# EAGLE design kinesis-advantage-v2.5 (EAGLE 7.2.0)
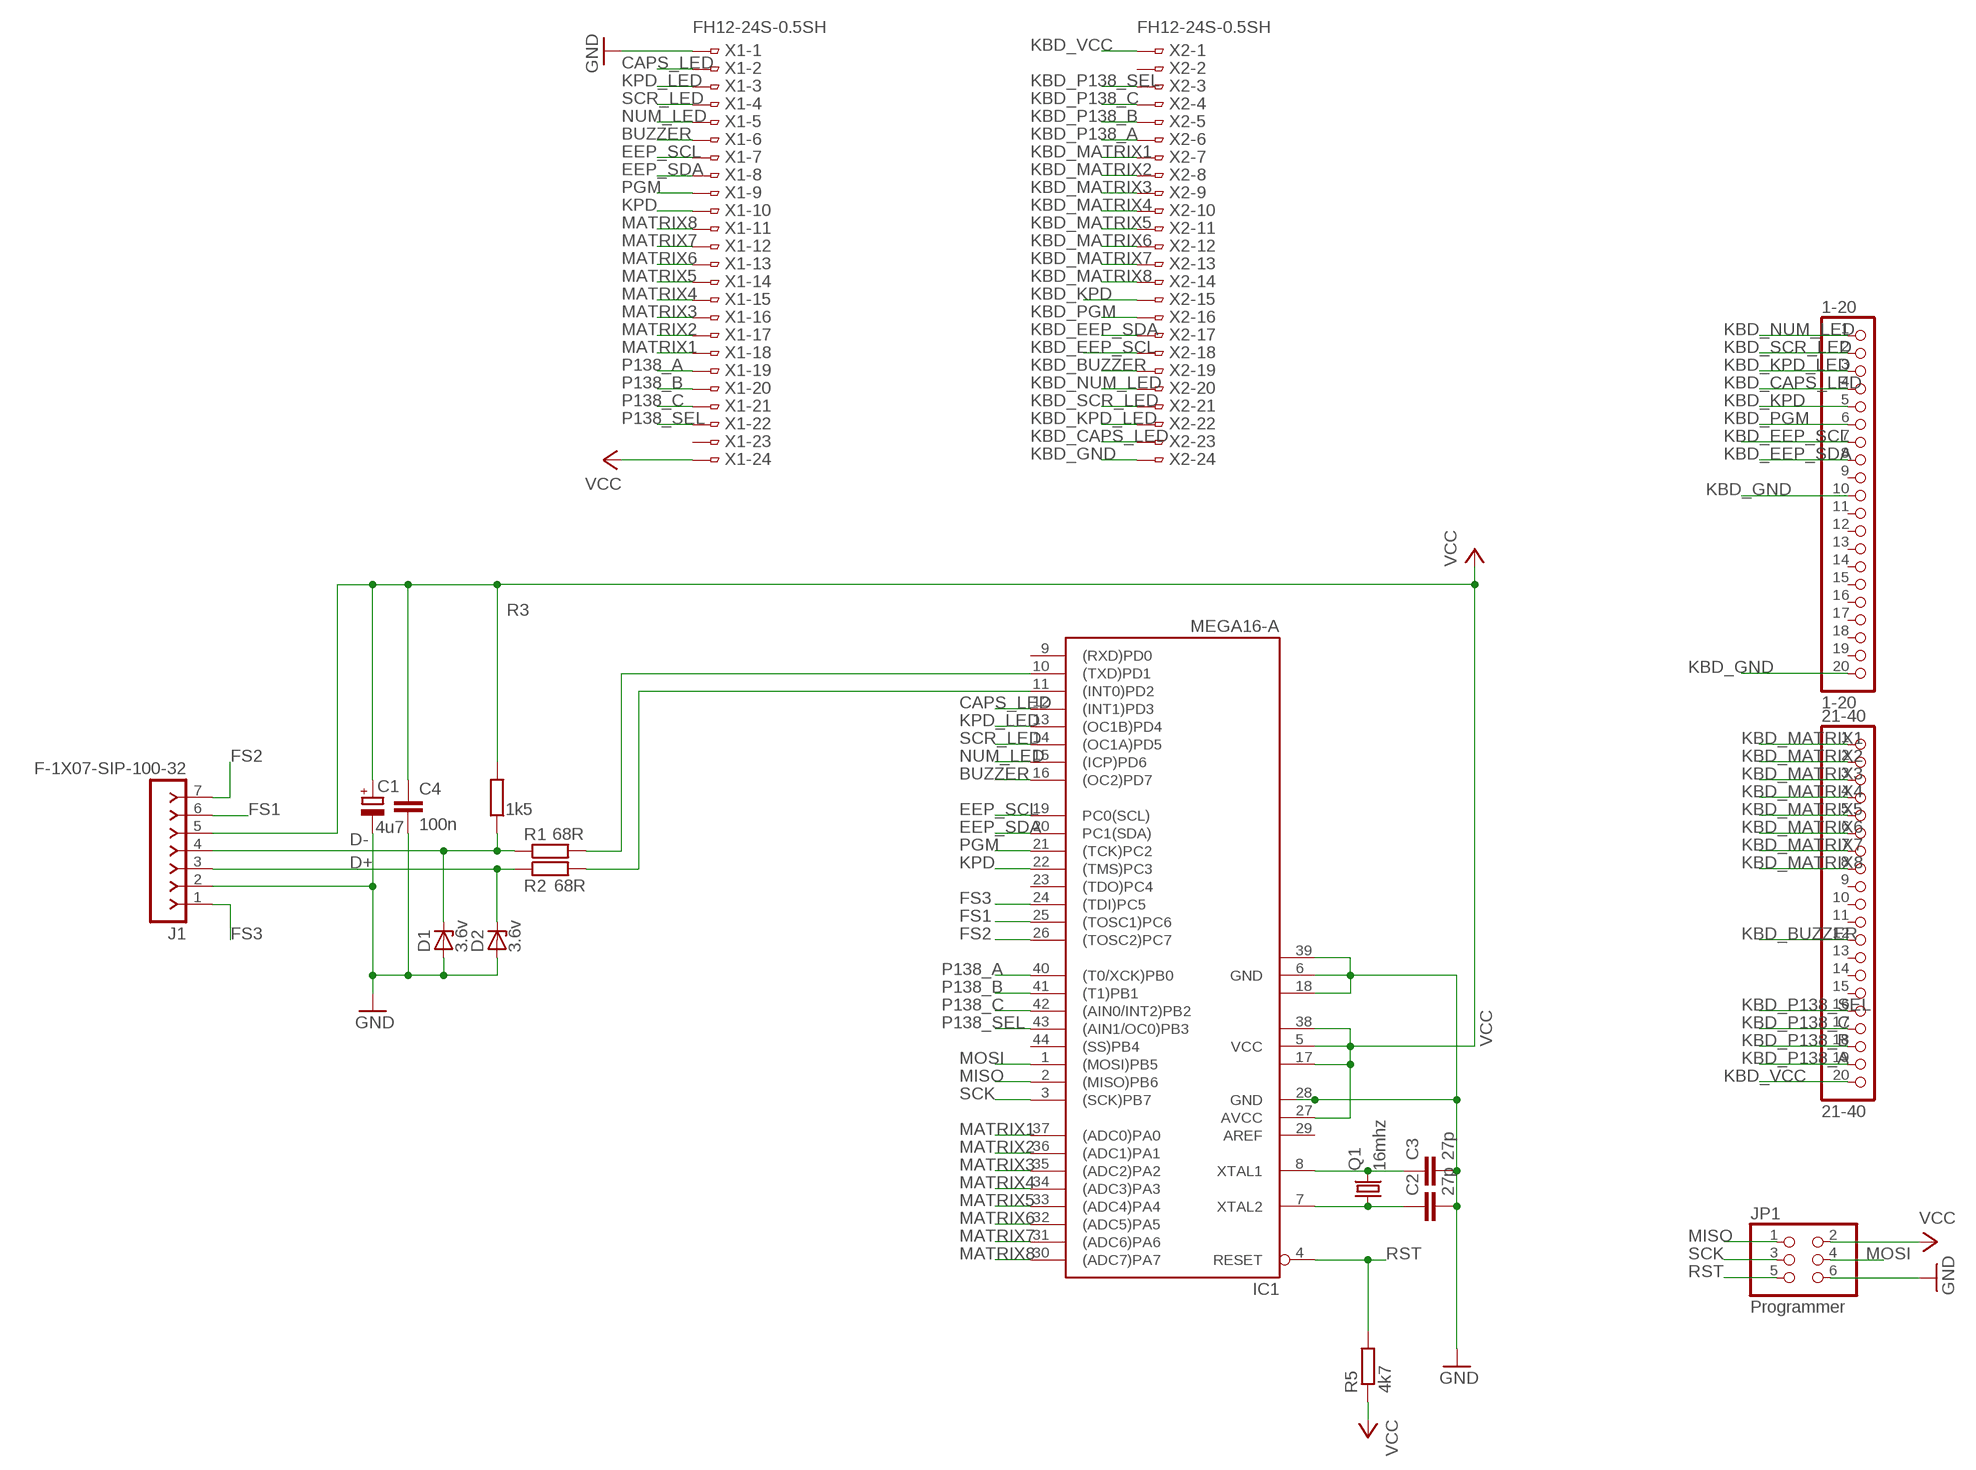
[diagram p0: schematic, sheet 1]

## Parts
1-20  1-20  PINHD-1X20-BIG  [1X20-BIG]
21-40  21-40  PINHD-1X20-BIG  [1X20-BIG]
C1  4u7  CPOL-EUE2-5  [E2-5]
C2  27p  C-EUC0603  [C0603]
C3  27p  C-EUC0603  [C0603]
C4  100n  C-EUC0603  [C0603]
D1  3.6v  ZENER-DIODESOD80C  [SOD80C]
D2  3.6v  ZENER-DIODESOD80C  [SOD80C]
IC1  MEGA16-A  [TQFP44]
J1  F-1X07-SIP-100-32  [SIP-100-07-32]
JP1  Programmer  PINHD-2X3  [2X03]
Q1  16mhz  CRYSTALHC49S  [HC49/S]
R1  68R  R-EU_R0603  [R0603]
R2  68R  R-EU_R0603  [R0603]
R3  1k5  R-EU_R0603  [R0603]
R5  4k7  R-EU_R0603  [R0603]
X1  FH12-24S-0.5SH  [FH12-24S-0.5SH]
X2  FH12-24S-0.5SH  [FH12-24S-0.5SH]

## Nets
BUZZER: IC1.16((OC2)PD7) X1.6
CAPS_LED: IC1.12((INT1)PD3) X1.2
CHIP-D+: IC1.11((INT0)PD2) R2.2
CHIP-D-: IC1.10((TXD)PD1) R1.2
D+: D2.C J1.3 R2.1
D-: D1.C J1.4 R1.1 R3.1
EEP_SCL: IC1.19(PC0(SCL)) X1.7
EEP_SDA: IC1.20(PC1(SDA)) X1.8
FS1: IC1.25((TOSC1)PC6) J1.6
FS2: IC1.26((TOSC2)PC7) J1.7
FS3: IC1.24((TDI)PC5) J1.1
GND: C1.- C2.2 C3.2 C4.2 D1.A D2.A IC1.6(GND) IC1.18(GND1) IC1.28(GND) IC1.39(GND2) J1.2 JP1.6 X1.1
KBD_BUZZER: 21-40.12 X2.19
KBD_CAPS_LED: 1-20.4 X2.23
KBD_EEP_SCL: 1-20.7 X2.18
KBD_EEP_SDA: 1-20.8 X2.17
KBD_GND: 1-20.10 1-20.20 X2.24
KBD_KPD: 1-20.5 X2.15
KBD_KPD_LED: 1-20.3 X2.22
KBD_MATRIX1: 21-40.1 X2.7
KBD_MATRIX2: 21-40.2 X2.8
KBD_MATRIX3: 21-40.3 X2.9
KBD_MATRIX4: 21-40.4 X2.10
KBD_MATRIX5: 21-40.5 X2.11
KBD_MATRIX6: 21-40.6 X2.12
KBD_MATRIX7: 21-40.7 X2.13
KBD_MATRIX8: 21-40.8 X2.14
KBD_NUM_LED: 1-20.1 X2.20
KBD_P138_A: 21-40.19 X2.6
KBD_P138_B: 21-40.18 X2.5
KBD_P138_C: 21-40.17 X2.4
KBD_P138_SEL: 21-40.16 X2.3
KBD_PGM: 1-20.6 X2.16
KBD_SCR_LED: 1-20.2 X2.21
KBD_VCC: 21-40.20 X2.1
KPD: IC1.22((TMS)PC3) X1.10
KPD_LED: IC1.13((OC1B)PD4) X1.3
MATRIX1: IC1.37((ADC0)PA0) X1.18
MATRIX2: IC1.36((ADC1)PA1) X1.17
MATRIX3: IC1.35((ADC2)PA2) X1.16
MATRIX4: IC1.34((ADC3)PA3) X1.15
MATRIX5: IC1.33((ADC4)PA4) X1.14
MATRIX6: IC1.32((ADC5)PA5) X1.13
MATRIX7: IC1.31((ADC6)PA6) X1.12
MATRIX8: IC1.30((ADC7)PA7) X1.11
MISO: IC1.2((MISO)PB6) JP1.1
MOSI: IC1.1((MOSI)PB5) JP1.4
NUM_LED: IC1.15((ICP)PD6) X1.5
P138_A: IC1.40((T0/XCK)PB0) X1.19
P138_B: IC1.41((T1)PB1) X1.20
P138_C: IC1.42((AIN0/INT2)PB2) X1.21
P138_SEL: IC1.43((AIN1/OC0)PB3) X1.22
PGM: IC1.21((TCK)PC2) X1.9
PIN9: C2.1 IC1.7(XTAL2) Q1.1
PIN10: C3.1 IC1.8(XTAL1) Q1.2
RST: IC1.4(RESET) JP1.5 R5.2
SCK: IC1.3((SCK)PB7) JP1.3
SCR_LED: IC1.14((OC1A)PD5) X1.4
VCC: C1.+ C4.1 IC1.5(VCC) IC1.17(VCC1) IC1.27(AVCC) IC1.38(VCC2) J1.5 JP1.2 R3.2 R5.1 X1.24
Unconnected: 1-20.9 1-20.11 1-20.12 1-20.13 1-20.14 1-20.15 1-20.16 1-20.17 1-20.18 1-20.19 21-40.9 21-40.10 21-40.11 21-40.13 21-40.14 21-40.15 IC1.9((RXD)PD0) IC1.23((TDO)PC4) IC1.29(AREF) IC1.44((SS)PB4) X1.23 X2.2

## Library data of the parts
1-20 21-40 = adafruit:PINHD-1X20: PIN HEADER
C1 = rcl:CPOL-EU: POLARIZED CAPACITOR, European symbol
C2-C4 = rcl:C-EU: CAPACITOR, European symbol
D1 D2 = diode:ZENER-DIODE: Z-Diode
IC1 = atmel:MEGA16: MICROCONTROLLER 16 Kbytes FLASH 1 kbytes SRAM 512 bytes EEPROM USART 8-channel 10 bit ADC Source: avr.lbr; MPN: ATMEGA16-16AU; OC_FARNELL: 9171134; OC_NEWARK: 96K6515
J1 = con-headers-jp:F-1X07-: FEMALE HEADER
JP1 = pinhead:PINHD-2X3: PIN HEADER
Q1 = crystal:CRYSTAL: CRYSTAL; OC_FARNELL: 1667008; OC_NEWARK: unknown
R1-R3 R5 = rcl:R-EU_: RESISTOR, European symbol
X1 X2 = con-hirose:FH12-24S-0.5S: 0.5mm Pitch Connectors For FPC/FFC Source: Data sheet <http://www.hirose.co.jp/cataloge_hp/e58605370.pdf>; MPN: FH12-24S-0.5SH(55); OC_FARNELL: 1324552; OC_NEWARK: 34M6170

## Board
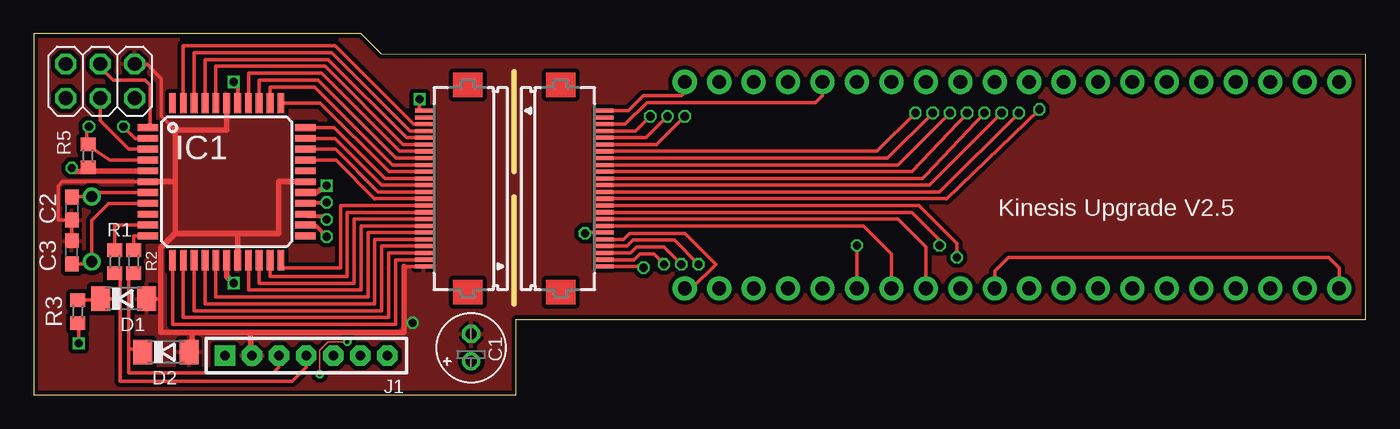
[diagram p1: board, top side]
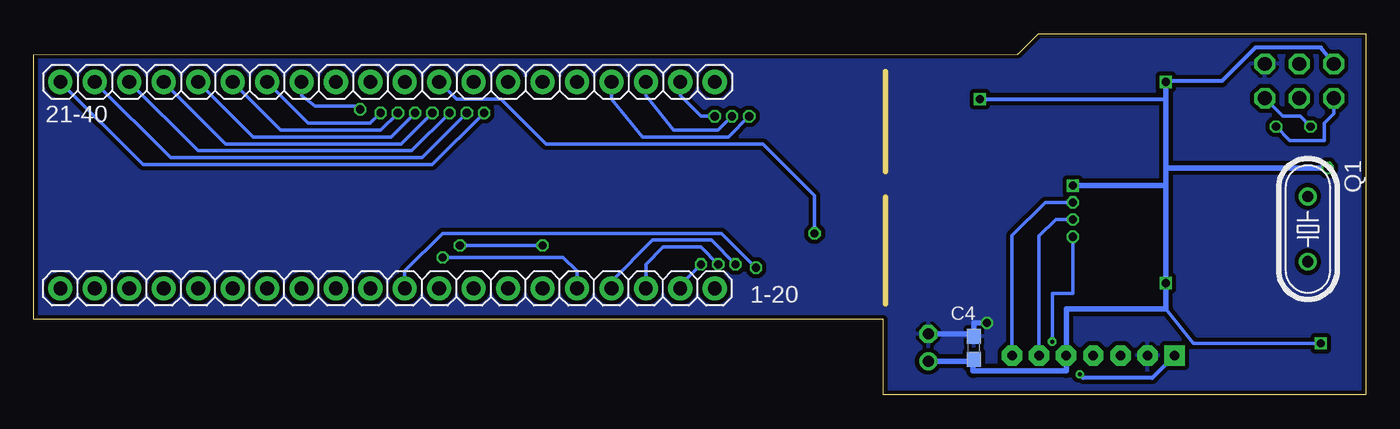
[diagram p2: board, bottom side, seen from below]

Size 98.22 x 26.66 mm. Coordinates in mm from the lower left corner, seen from the top.
Outline: 0,0 35.56,0 35.56,5.59 98.22,5.59 98.22,25.14 25.65,25.15 24.14,26.66 0,26.66 0,0
Copper layers (1*16): Top 0.035mm / dielectric 1.5mm / Bottom 0.035mm
Design rules "dirt_cheap_dirty_boards.v1": minimum track width 5mil, minimum drill 12mil, track to track 5mil, track to pad 5mil, pad to pad 5mil, via to via 5mil, smd to smd 0mil, copper to edge 10mil, drill to drill 10mil, minimum pad ring 10mil, minimum via ring 6mil, stop-mask expansion 2mil, vias tented up to drill 25mil, thermal gap 10mil
Milling: 2 lines

### Footprints (pad centres in the part's own frame; a part is rotated, then mirrored left to right if it is on the bottom)
1X20-BIG = drill 1.016 pad 1.778: 1 -24.13,0; 2 -21.59,0; 3 -19.05,0; 4 -16.51,0; 5 -13.97,0; 6 -11.43,0; 7 -8.89,0; 8 -6.35,0; 9 -3.81,0; 10 -1.27,0; 11 1.27,0; 12 3.81,0; 13 6.35,0; 14 8.89,0; 15 11.43,0; 16 13.97,0; 17 16.51,0; 18 19.05,0; 19 21.59,0; 20 24.13,0
E2-5 = drill 0.813 pad 1.27: + -1.016,0 | drill 0.813 pad 1.27 octagon: - 1.016,0
C0603 = smd 1.1 x 1: 1 -0.85,0; 2 0.85,0
SOD80C = smd 1.4 x 1.8: A 1.7,0; C -1.7,0
TQFP44 = smd 1.5 x 0.5: 1 -5.8,4; 2 -5.8,3.2; 3 -5.8,2.4; 4 -5.8,1.6; 5 -5.8,0.8; 6 -5.8,0; 7 -5.8,-0.8; 8 -5.8,-1.6; 9 -5.8,-2.4; 10 -5.8,-3.2; 11 -5.8,-4; 23 5.8,-4; 24 5.8,-3.2; 25 5.8,-2.4; 26 5.8,-1.6; 27 5.8,-0.8; 28 5.8,0; 29 5.8,0.8; 30 5.8,1.6; 31 5.8,2.4; 32 5.8,3.2; 33 5.8,4 | smd 0.5 x 1.5: 12 -4,-5.8; 13 -3.2,-5.8; 14 -2.4,-5.8; 15 -1.6,-5.8; 16 -0.8,-5.8; 17 0,-5.8; 18 0.8,-5.8; 19 1.6,-5.8; 20 2.4,-5.8; 21 3.2,-5.8; 22 4,-5.8; 34 4,5.8; 35 3.2,5.8; 36 2.4,5.8; 37 1.6,5.8; 38 0.8,5.8; 39 0,5.8; 40 -0.8,5.8; 41 -1.6,5.8; 42 -2.4,5.8; 43 -3.2,5.8; 44 -4,5.8
SIP-100-07-32 = drill 0.7 pad 1.5 square: 1 -7,0 | drill 0.7 pad 1.5 octagon: 2 -5,0; 3 -3,0; 4 -1,0; 5 1,0; 6 3,0; 7 5,0
2X03 = drill 1.016 octagon: 1 -2.54,-1.27; 2 -2.54,1.27; 3 0,-1.27; 4 0,1.27; 5 2.54,-1.27; 6 2.54,1.27
HC49/S = drill 0.813: 1 -2.413,0; 2 2.413,0
R0603 = smd 1 x 1.1: 1 -0.85,0; 2 0.85,0
FH12-24S-0.5SH = smd 0.3 x 1.3: 1 -5.75,3.25; 2 -5.25,3.25; 3 -4.75,3.25; 4 -4.25,3.25; 5 -3.75,3.25; 6 -3.25,3.25; 7 -2.75,3.25; 8 -2.25,3.25; 9 -1.75,3.25; 10 -1.25,3.25; 11 -0.75,3.25; 12 -0.25,3.25; 13 0.25,3.25; 14 0.75,3.25; 15 1.25,3.25; 16 1.75,3.25; 17 2.25,3.25; 18 2.75,3.25; 19 3.25,3.25; 20 3.75,3.25; 21 4.25,3.25; 22 4.75,3.25; 23 5.25,3.25; 24 5.75,3.25

### Placement (x,y rotation side)
1-20  72.14,7.87 180 bottom
21-40  72.14,23.11 0 bottom
C1  32.26,3.49 90 top
C2  2.79,13.78 270 top
C3  2.79,10.54 90 top
C4  28.89,3.49 90 bottom
D1  6.63,7.11 0 top
D2  9.74,3.17 0 top
IC1  14.22,15.75 0 top
J1  21.08,2.92 0 top
JP1  4.89,23.18 0 top
Q1  4.25,12.26 270 bottom
R1  5.97,9.84 90 top
R2  7.37,9.84 90 top
R3  3.24,6.16 270 top
R5  4,17.65 90 top
X1  32,15.24 90 top
X2  38.86,15.24 270 top

### Tracks (layer width: path | path; a pad name or v marks a point on that pad's centre or on a via)
BUZZER
  Top 0.254: 13.53,9.85 IC1.16 13.42,7.24 24.64,7.24 24.64,11.99 X1.6
CAPS_LED
  Top 0.254: X1.2 26.67,9.99 26.67,5.21 10.22,5.21 IC1.12
CHIP-D+
  Top 0.254: IC1.11 7.37,11.75 R2.2
CHIP-D-
  Top 0.254: R1.2 5.97,12.55 IC1.10
D+
  Top 0.254: 6.99,3.43 6.99,1.65 17.65,1.65 18.03,2.03 18.03,2.87 J1.3 | D2.C 6.99,3.43 | R2.1 6.99,8.99 6.99,3.43
D-
  Top 0.254: 6.35,7.11 D1.C 4.83,7.01 R3.1 | 6.35,7.11 6.35,1.02 19.05,1.02 20.07,2.03 20.07,2.91 J1.4 | R1.1 6.35,8.99 6.35,7.11
EEP_SCL
  Top 0.254: X1.7 24.13,12.49 24.13,7.75 15.82,7.75 IC1.19
EEP_SDA
  Top 0.254: X1.8 23.62,12.99 23.62,8.26 16.62,8.26 IC1.20
FS1  (via drill 0.6)
  Top 0.305: IC1.25 20.16,13.21 21.59,13.21 v21.59,12.95
  Bottom 0.254: J1.6 24.08,11.73 22.86,12.95 v21.59,12.95
FS2  (via drill 0.6)
  Top 0.305: IC1.26 20.1,14.22 v21.59,14.22
  Bottom 0.254: J1.7 26.08,11.76 23.62,14.22 v21.59,14.22
FS3  (via drill 0.3, 0.6)
  Top 0.127: v23.11,3.94 21.72,3.94 21.08,3.3 v21.08,1.52
  Top 0.305: IC1.24 20.73,12.55 v21.59,11.68
  Bottom 0.254: v21.59,11.68 21.59,7.49 23.11,7.49 v23.11,3.94
  Bottom 0.305: J1.1 15.73,1.27 20.83,1.27 v21.08,1.52
GND  (via drill 0.6)
  Top 0.254: D1.A 9.34,7.11 | IC1.6 2.1,15.75 1.78,15.43 1.78,12.93 C2.2 C3.2 | X1.1 27.3,9.49 | D2.A 11.68,3.56 | JP1.6 7.49,24.38 8.38,24.38 9.4,23.37 9.4,20.57 10.41,19.56
  Top 0.406: 16,4.64 27.3,4.64 27.3,5.33 | 16,4.64 11.68,4.64 | IC1.18 15.02,11.94 | 15.02,11.94 10.41,11.94 | 10.41,11.94 9.34,10.86 9.34,7.11 9.34,4.64 11.68,4.64 | IC1.6 10.41,15.75 | 10.41,15.75 10.41,11.94 | 10.41,15.75 10.41,19.56 14.22,19.56 IC1.39 | IC1.28 18.03,15.75 18.03,11.94 15.02,11.94 | 27.3,9.49 27.3,5.33 | 11.68,3.56 11.68,4.64 | J1.2 16,2.92 16,4.64 | v27.94,5.33 27.3,5.33
  Bottom 0.406: C1.- 28.89,4.51 C4.2 28.89,5.33 v27.94,5.33
  pour Top (isolate 0.305): 0,26.67 0,0 35.56,0 35.56,5.59 98.3,5.84 98.3,25.15 25.65,25.15 24.13,26.67
  pour Bottom (isolate 0.305): 0,26.67 0,0 35.56,0 35.56,5.59 98.3,5.84 98.3,25.15 25.65,25.15 24.13,26.67
KBD_BUZZER  (via drill 0.6)
  Top 0.254: X2.19 40.69,11.99 v40.64,11.94
  Bottom 0.254: v40.64,11.94 40.64,14.73 44.45,18.54 60.45,18.54 63.75,21.84 67.06,21.84 21-40.12
KBD_CAPS_LED  (via drill 0.6)
  Top 0.254: X2.23 44.28,9.99 44.7,10.41 45.72,10.41 v46.48,9.65
  Bottom 0.254: v46.48,9.65 48.26,11.43 52.58,11.43 55.63,8.38 1-20.4
KBD_EEP_SCL
  Top 0.254: X2.18 61.17,12.49 63.25,10.41 1-20.7
KBD_EEP_SDA
  Top 0.254: X2.17 63.72,12.99 65.79,10.92 1-20.8
KBD_GND  (via drill 0.6)
  Top 0.254: 1-20.20 96.27,9.4 95.5,10.16 71.88,10.16 70.87,9.14 1-20.10 | X2.24 44.8,9.49 v44.96,9.4
  Bottom 0.254: v44.96,9.4 47.5,11.94 68.07,11.94 70.87,9.14 1-20.10
KBD_KPD  (via drill 0.6)
  Top 0.254: X2.15 65.26,13.99 68.07,11.18 v68.07,10.16
  Bottom 0.254: v68.07,10.16 59.18,10.16 58.17,9.14 1-20.5
KBD_KPD_LED  (via drill 0.6)
  Top 0.254: X2.22 44.02,10.49 44.45,10.92 46.48,10.92 v47.75,9.65
  Bottom 0.254: v47.75,9.65 49.02,10.92 51.82,10.92 53.09,9.65 1-20.3
KBD_MATRIX1  (via drill 0.6)
  Top 0.254: X2.7 62.19,17.99 v65.02,20.83
  Bottom 0.254: v65.02,20.83 68.83,17.02 90.17,17.02 21-40.1
KBD_MATRIX2  (via drill 0.6)
  Top 0.254: X2.8 62.96,17.49 v66.29,20.83
  Bottom 0.254: v66.29,20.83 69.6,17.53 88.14,17.53 21-40.2
KBD_MATRIX3  (via drill 0.6)
  Top 0.254: v67.56,20.83 63.73,16.99 X2.9
  Bottom 0.254: 21-40.3 86.11,18.03 70.36,18.03 v67.56,20.83
KBD_MATRIX4  (via drill 0.6)
  Top 0.254: v68.83,20.83 64.75,16.49 X2.10
  Bottom 0.254: 21-40.4 84.07,18.54 71.12,18.54 v68.83,20.83
KBD_MATRIX5  (via drill 0.6)
  Top 0.254: v70.1,20.83 65.79,16.26 65.52,15.99 X2.11
  Bottom 0.254: 21-40.5 82.04,19.05 71.88,19.05 v70.1,20.83
KBD_MATRIX6  (via drill 0.6)
  Top 0.254: v71.37,20.83 66.04,15.49 X2.12
  Bottom 0.254: 21-40.6 80.01,19.56 72.64,19.56 v71.37,20.83
KBD_MATRIX7  (via drill 0.6)
  Top 0.254: v72.64,20.83 66.81,14.99 X2.13
  Bottom 0.254: 21-40.7 77.98,20.07 73.41,20.07 v72.64,20.83
KBD_MATRIX8  (via drill 0.6)
  Top 0.254: v74.17,21.08 67.31,14.48 67.3,14.49 X2.14
  Bottom 0.254: 21-40.8 78.49,22.1 77.47,21.34 74.42,21.34 v74.17,21.08
KBD_NUM_LED
  Top 0.254: X2.20 43.49,11.49 43.94,11.94 48.01,11.94 50.29,9.65 48.51,7.87 1-20.1
KBD_P138_A  (via drill 0.6)
  Top 0.254: v48.01,20.57 45.92,18.49 X2.6
  Bottom 0.254: v48.01,20.57 49.02,20.57 50.55,22.1 21-40.19
KBD_P138_B  (via drill 0.6)
  Top 0.254: X2.5 45.15,18.99 v46.74,20.57
  Bottom 0.254: v46.74,20.57 47.75,19.56 51.05,19.56 53.09,22.1 21-40.18
KBD_P138_C  (via drill 0.6)
  Top 0.254: X2.4 44.38,19.49 v45.47,20.57
  Bottom 0.254: 21-40.17 55.63,21.84 53.34,19.05 46.99,19.05 v45.47,20.57
KBD_P138_SEL
  Top 0.254: X2.3 43.61,19.99 45.21,21.59 57.66,21.59 58.17,22.1 21-40.16
KBD_PGM  (via drill 0.6)
  Top 0.254: X2.16 64.74,13.49 66.8,11.43 v66.8,11.05 | v60.71,11.05 1-20.6
  Bottom 0.254: v66.8,11.05 v60.71,11.05
KBD_SCR_LED  (via drill 0.6)
  Top 0.254: X2.21 43.76,10.99 44.2,11.43 47.24,11.43 v49.02,9.65
  Bottom 0.254: v49.02,9.65 50.55,8.13 1-20.2
KBD_VCC
  Top 0.254: X2.1 43.85,20.99 44.96,22.1 47.75,22.1 48.01,22.35 21-40.20
KPD
  Top 0.254: X1.10 22.61,13.99 22.61,9.4 18.22,9.4 IC1.22
KPD_LED
  Top 0.254: X1.3 26.16,10.49 26.16,5.71 11.02,5.71 IC1.13
MATRIX1
  Top 0.254: X1.18 26.97,17.99 21.21,23.75 15.82,23.75 IC1.37
MATRIX2
  Top 0.254: X1.17 26.71,17.49 20.95,23.24 16.62,23.24 IC1.36
MATRIX3
  Top 0.254: IC1.35 17.42,22.73 20.7,22.73 26.44,16.99 X1.16
MATRIX4
  Top 0.254: IC1.34 21.12,21.55 26.18,16.49 X1.15
MATRIX5
  Top 0.254: IC1.33 22.16,19.75 25.92,15.99 X1.14
MATRIX6
  Top 0.254: IC1.32 22.2,18.95 25.66,15.49 X1.13
MATRIX7
  Top 0.254: IC1.31 22.24,18.15 25.4,14.99 X1.12
MATRIX8
  Top 0.254: IC1.30 22.28,17.35 25.15,14.48 25.16,14.49 X1.11
MISO  (via drill 0.6)
  Top 0.254: IC1.2 7.47,18.95 v6.6,19.81
  Bottom 0.254: v6.6,19.81 5.59,18.8 3.05,18.8 3.05,20.07 2.35,20.76 JP1.1
MOSI
  Top 0.254: 8.38,19.81 IC1.1 8.57,20.11 8.57,22.86 8.19,23.24 5.84,23.24 4.89,24.19 JP1.4
NUM_LED
  Top 0.254: X1.5 25.15,11.49 25.15,6.73 12.62,6.73 IC1.15
P138_A
  Top 0.254: X1.19 27.23,18.49 21.46,24.26 13.42,24.26 IC1.40
P138_B
  Top 0.254: X1.20 27.49,18.99 21.72,24.76 12.62,24.76 IC1.41
P138_C
  Top 0.254: X1.21 27.75,19.49 21.97,25.27 11.82,25.27 IC1.42
P138_SEL
  Top 0.254: X1.22 28.02,19.99 22.23,25.78 11.02,25.78 IC1.43
PGM
  Top 0.254: X1.9 23.11,13.49 23.11,8.76 17.42,8.76 IC1.21
PIN9
  Top 0.254: IC1.7 4.25,14.95 Q1.1 2.96,14.67 C2.1
PIN10
  Top 0.254: IC1.8 5.51,14.15 4.25,12.89 Q1.2 4.1,9.69 C3.1
RST  (via drill 0.6)
  Top 0.254: IC1.4 5.58,17.35 3.91,18.5 | R5.2 3.91,18.5 | 3.91,18.5 3.79,18.5 3.75,18.54 | 3.91,18.5 3.91,19.66 v4.06,19.81
  Bottom 0.254: v4.06,19.81 4.83,20.57 6.1,20.57 JP1.5
SCK
  Top 0.254: IC1.3 7,18.15 4.89,20.26 JP1.3
SCR_LED
  Top 0.254: X1.4 25.65,10.99 25.65,6.22 11.82,6.22 IC1.14
VCC  (via drill 0.6)
  Top 0.254: R3.2 3.3,5.25 v3.3,3.81
  Top 0.305: IC1.5 8.46,16.51 | v14.73,23.11 15.02,23.11 IC1.38 | X1.24 28.45,20.99 v28.45,21.84
  Top 0.406: IC1.17 14.22,8.76 v14.73,8.26 | 8.39,16.51 IC1.5 4.16,16.55 R5.1 3.71,16.51 3.05,16.51 v2.79,16.76 | IC1.27 20.83,14.95 v21.59,15.46
  Bottom 0.254: 14.73,6.35 12.7,3.81 v3.3,3.81
  Bottom 0.305: JP1.2 3.3,25.65 8.13,25.65 10.6,23.18 14.67,23.18 v14.73,23.11 14.73,21.84 v28.45,21.84
  Bottom 0.406: 14.73,15.46 v14.73,8.26 14.73,6.35 22.08,6.35 J1.5 22.08,1.78 28.96,1.78 28.96,2.64 C4.1 28.89,2.48 C1.+ | v14.73,23.11 14.73,16.76 | v2.79,16.76 14.73,16.76 | 14.73,16.76 14.73,15.46 | 14.73,15.46 v21.59,15.46

### Text on the board
tPlace: Kinesis Upgrade V2.5